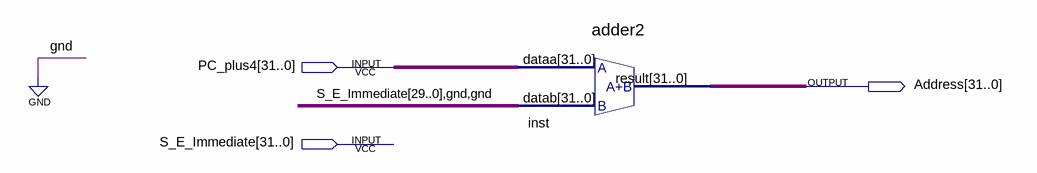
[diagram p0: schematic sheet]
// Quartus schematic BranchAddress.bdf as structural Verilog: 1 symbols, 3 pins
module BranchAddress (
  input  [31:0] PC_plus4,
  input  [31:0] S_E_Immediate,
  output [31:0] Address
);

  adder2 inst (.dataa(PC_plus4), .datab({S_E_Immediate[29:0], 2'b00}), .result(Address));
endmodule
